# Altium schematic sheet LCDTFT_RTP_CONN.SchDoc
size A3; SheetNumber: 21; SheetTotal: 21
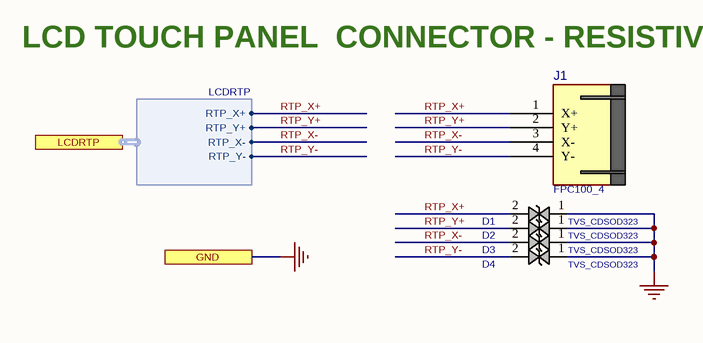
[diagram p0: LCDTFT_RTP_CONN.SchDoc]

## Parts
D1  TVS_CDSOD323  [D0805]
D2  TVS_CDSOD323  [D0805]
D3  TVS_CDSOD323  [D0805]
D4  TVS_CDSOD323  [D0805]
J1  FPC100_4  [FPC100_4HT]

## Ports
GND, LCDRTP (harness LCDRTP)

## Harnesses
LCDRTP: RTP_X+, RTP_Y+, RTP_X-, RTP_Y-

## Nets
GND: D1.1 D2.1 D3.1 D4.1 ; port GND
RTP_X+: D1.2 J1.1(X+) ; port LCDRTP.RTP_X+
RTP_X-: D3.2 J1.3(X-) ; port LCDRTP.RTP_X-
RTP_Y+: D2.2 J1.2(Y+) ; port LCDRTP.RTP_Y+
RTP_Y-: D4.2 J1.4(Y-) ; port LCDRTP.RTP_Y-

## Notes on the sheet
- LCD TOUCH PANEL  CONNECTOR - RESISTIVE

## Library data of the parts
D1-D4 = TVS_CDSOD323: TVS, ESD PROTECT, Bidirectional; MANF_P#: CDSOD323-T12C; MANF: Bourns; PARAM2: 13.3VB, 12VR; PRICE: 0.7$; VALUE: TVS_CDSOD323
J1 = LCD_RTP_FPC4P: LCD Resistive touch, FPC 4pin; MANF: -; MANF_P#: -; PARAM: -; VALUE: FPC100_4